# Altium schematic sheet Sensing.SchDoc
size A4
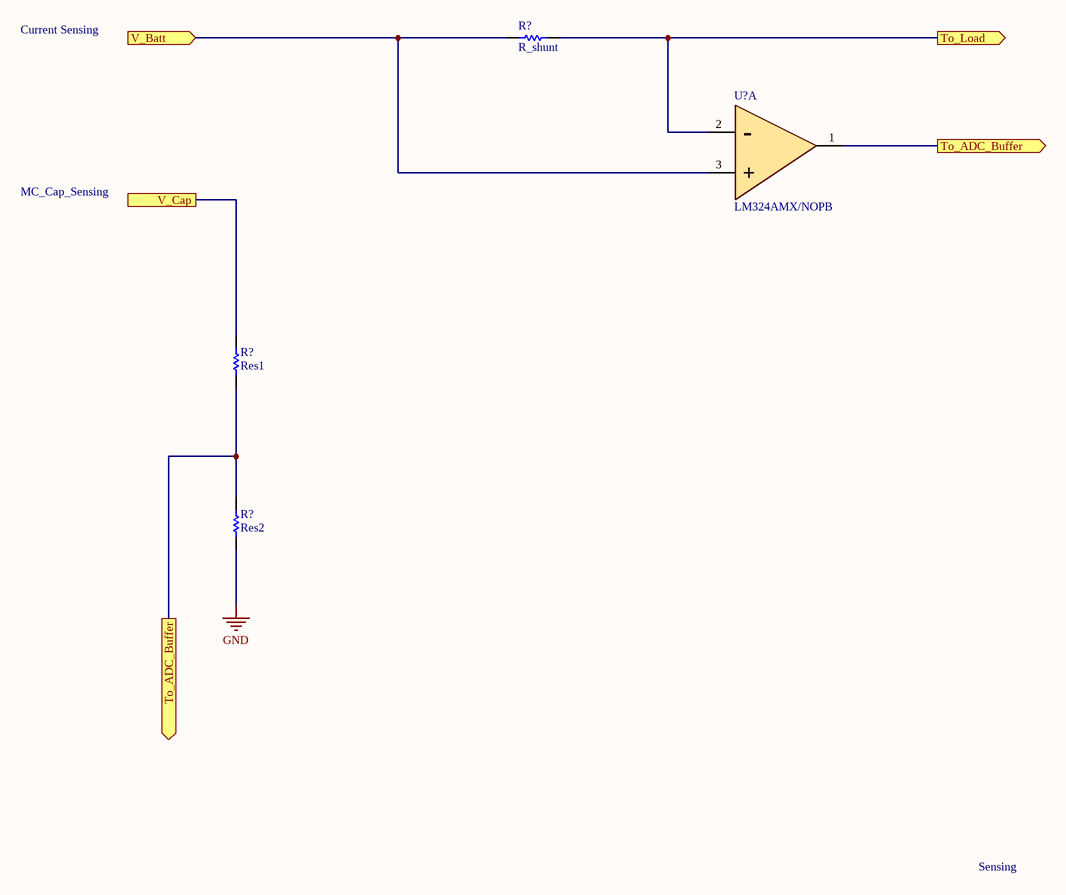
[diagram p0: Sensing.SchDoc]

## Parts
(Parts that share a designator on the sheet are numbered #1, #2 ... from top to bottom, then left to right.)
R?#1  value R_shunt  [0603 - Resistor]  (hidden comment: Resistor)
R?#2  Res1  [AXIAL-0.3]
R?#3  Res2  [AXIAL-0.3]
U?  LM324AMX/NOPB  [LM324AMX/NOPB]  (part A of 5)

## Ports
To_ADC_Buffer (out), To_Load (out), V_Batt (in), V_Cap

## Nets
GND: R?#3.1
To_ADC_Buffer: R?#2.1 R?#3.2 U?.1 ; port To_ADC_Buffer
To_Load: R?#1.2 U?.2(-) ; port To_Load
V_Batt: R?#1.1 U?.3(+) ; port V_Batt
V_Cap: R?#2.2 ; port V_Cap

## Notes on the sheet
- Current Sensing
- MC_Cap_Sensing
- Sensing

## Library data of the parts
R?#2 R?#3 = Res1: Resistor; Published: 8-Jun-2000; LatestRevisionDate: 17-Jul-2002; LatestRevisionNote: Re-released for DXP Platform.; PackageReference: AXIAL-0.3; Publisher: Altium Limited; PackageDescription: Axial Device, Thru-Hole; 2 Leads; 0.3 in Pin Spacing
R?#1 = Resistor: Rating: *; Manufacturer Part Number: *; Manufacturer: *; Supplier Part Number: *; Supplier: *